# EAGLE design Power Board (EAGLE 9.6.2)
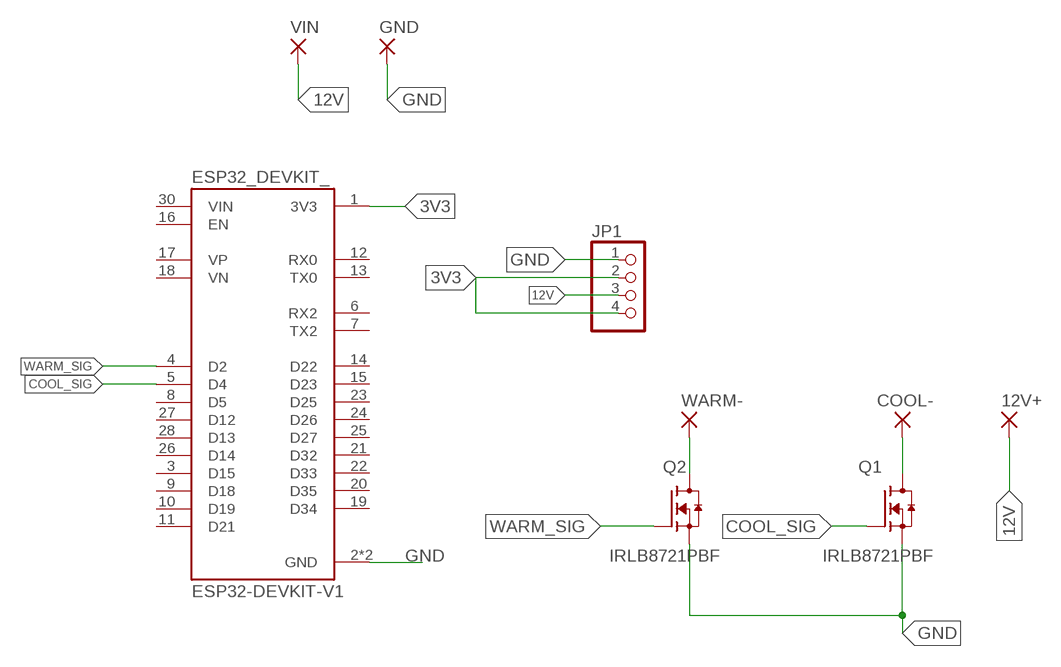
[diagram p0: schematic, sheet 1]

## Parts
12V+  WIREPADSMD5-2,5  [5-2,5]
COOL-  WIREPADSMD5-2,5  [5-2,5]
ESP32_DEVKIT_  ESP32-DEVKIT-V1  [MODULE_ESP32_DEVKIT_V1]
GND  WIREPADSMD5-2,5  [5-2,5]
JP1  PINHD-1X4  [1X04]
Q1  IRLB8721PBF  [TO254P1067X483X2057-3]
Q2  IRLB8721PBF  [TO254P1067X483X2057-3]
VIN  WIREPADSMD5-2,5  [5-2,5]
WARM-  WIREPADSMD5-2,5  [5-2,5]

## Nets
3V3 [POWER]: ESP32_DEVKIT_.1(3V3) JP1.2 JP1.4
12V [POWER]: 12V+.1(P) JP1.3 VIN.1(P)
COOL- [POWER]: COOL-.1(P) Q1.2(D)
COOL_SIG [SIGNAL]: ESP32_DEVKIT_.5(D4) Q1.1(G)
GND [POWER]: ESP32_DEVKIT_.2(GND) ESP32_DEVKIT_.29(GND) GND.1(P) JP1.1 Q1.3(S) Q2.3(S)
WARM- [POWER]: Q2.2(D) WARM-.1(P)
WARM_SIG [SIGNAL]: ESP32_DEVKIT_.4(D2) Q2.1(G)
Unconnected: ESP32_DEVKIT_.3(D15) ESP32_DEVKIT_.6(RX2) ESP32_DEVKIT_.7(TX2) ESP32_DEVKIT_.8(D5) ESP32_DEVKIT_.9(D18) ESP32_DEVKIT_.10(D19) ESP32_DEVKIT_.11(D21) ESP32_DEVKIT_.12(RX0) ESP32_DEVKIT_.13(TX0) ESP32_DEVKIT_.14(D22) ESP32_DEVKIT_.15(D23) ESP32_DEVKIT_.16(EN) ESP32_DEVKIT_.17(VP) ESP32_DEVKIT_.18(VN) ESP32_DEVKIT_.19(D34) ESP32_DEVKIT_.20(D35) ESP32_DEVKIT_.21(D32) ESP32_DEVKIT_.22(D33) ESP32_DEVKIT_.23(D25) ESP32_DEVKIT_.24(D26) ESP32_DEVKIT_.25(D27) ESP32_DEVKIT_.26(D14) ESP32_DEVKIT_.27(D12) ESP32_DEVKIT_.28(D13) ESP32_DEVKIT_.30(VIN)

## Library data of the parts
12V+ COOL- GND VIN WARM- = wirepad:WIREPAD: Wire PAD connect wire on PCB
ESP32_DEVKIT_ = ESP32-DEVKIT-V1:ESP32-DEVKIT-V1: Dual core, Wi-Fi: 2.4 GHz up to 150 Mbits/s,BLE (Bluetooth Low Energy) and legacy Bluetooth, 32 bits, Up to 240 MHz Check availability <https://pricing.snapeda.com/parts/ESP32-DEVKIT-V1/Do%20it/view-part?ref=eda>; AVAILABILITY: Not in stock; DESCRIPTION: Dual core, Wi-Fi: 2.4 GHz up to 150 Mbits/s,BLE (Bluetooth Low Energy) and legacy Bluetooth, 32 bits, Up to 240 MHz; MF: Do it; MP: ESP32-DEVKIT-V1; PACKAGE: None; PRICE: None
JP1 = pinhead:PINHD-1X4: PIN HEADER
Q1 Q2 = IRLB8721PBF:IRLB8721PBF: Single N-Channel 30 V 8.7 mOhm 13 nC HEXFET® Power Mosfet - TO-220-3 Check availability <https://pricing.snapeda.com/parts/IRLB8721PBF/Infineon%20Technologies/view-part?ref=eda>; AVAILABILITY: In Stock; DESCRIPTION: Very Low RDS(on) at 4.5V VGS | Ultra-Low Gate Impedance | Fully Characterized Avalanche Voltage and Current | Lead-Free; MF: Infineon Technologies; MP: IRLB8721PBF; PACKAGE: TO-220 Infineon; PRICE: None; PURCHASE-URL: https://pricing.snapeda.com/search/part/IRLB8721PBF/?ref=eda

## Net classes
1 POWER: width 0.305 mm

## Board
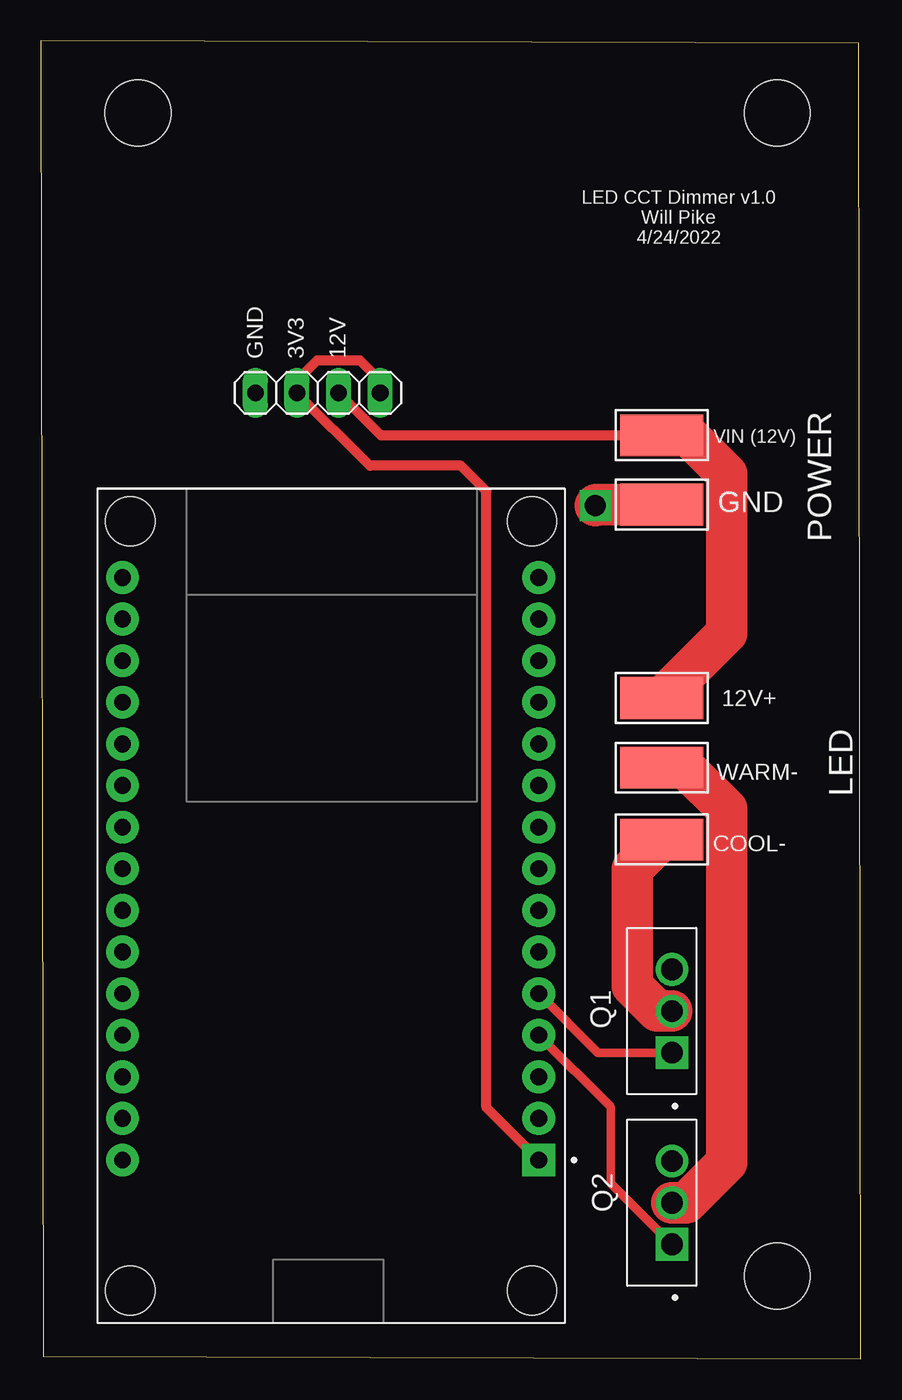
[diagram p1: board, top side]
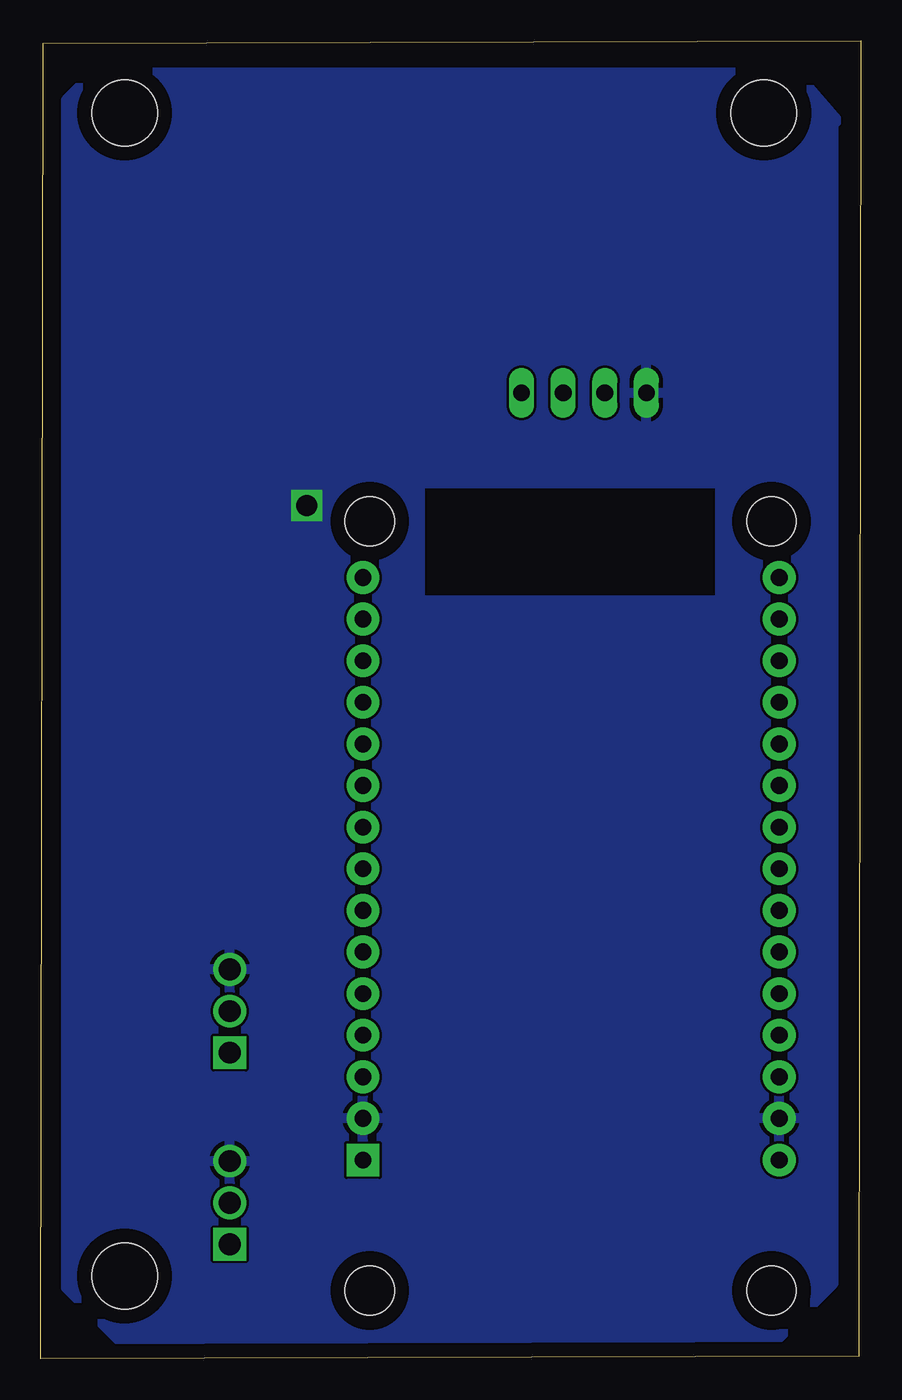
[diagram p2: board, bottom side, seen from below]

Size 50.03 x 80.43 mm. Coordinates in mm from the lower left corner, seen from the top.
Outline: 0.13,0.13 50.03,0 49.9,80.3 0,80.43 0.13,0.13
Copper layers (1*16): Top 0.035mm / dielectric 1.5mm / Bottom 0.035mm
Design rules "default *": minimum track width 6mil, minimum drill 0.3mm, track to track 6mil, track to pad 6mil, pad to pad 6mil, via to via 6mil, smd to smd 6mil, copper to edge 35mil, drill to drill 6mil, minimum pad ring 10mil, minimum via ring 8mil, stop-mask expansion 4mil, vias tented up to drill 0mil, thermal gap 10mil
Holes 4 mm at 5.92,76.03 44.92,76.03 44.92,5.03

### Footprints (pad centres in the part's own frame; a part is rotated, then mirrored left to right if it is on the bottom)
5-2,5 = smd 2.54 x 5.08: 1 0,0
MODULE_ESP32_DEVKIT_V1 = drill 1.02 pad 2 square: 1 -12.7,15.515 | drill 1.02 pad 2: 2 -12.7,12.975; 3 -12.7,10.435; 4 -12.7,7.895; 5 -12.7,5.355; 6 -12.7,2.815; 7 -12.7,0.275; 8 -12.7,-2.265; 9 -12.7,-4.805; 10 -12.7,-7.345; 11 -12.7,-9.885; 12 -12.7,-12.425; 13 -12.7,-14.965; 14 -12.7,-17.505; 15 -12.7,-20.045; 16 12.7,-20.045; 17 12.7,-17.505; 18 12.7,-14.965; 19 12.7,-12.425; 20 12.7,-9.885; 21 12.7,-7.345; 22 12.7,-4.805; 23 12.7,-2.265; 24 12.7,0.275; 25 12.7,2.815; 26 12.7,5.355; 27 12.7,7.895; 28 12.7,10.435; 29 12.7,12.975; 30 12.7,15.515 | hole 3: -12.28,-23.475; 12.23,-23.475; 12.23,23.475; -12.28,23.475
1X04 = drill 1.016 long: 1 -3.81,0; 2 -1.27,0; 3 1.27,0; 4 3.81,0
TO254P1067X483X2057-3 = drill 1.33 pad 2 square: 1 -2.54,0 | drill 1.33 pad 2: 2 0,0; 3 2.54,0

### Placement (x,y rotation side)
12V+  37.88,40.32 90 top
COOL-  37.88,31.68 90 top
ESP32_DEVKIT_  17.68,27.63 180 top
GND  37.88,52.13 270 top
JP1  16.89,58.94 0 top
Q1  38.5,21.21 90 top
Q2  38.5,9.51 90 top
VIN  37.88,56.36 90 top
WARM-  37.88,36.06 90 top

### Tracks (layer width: path | path; a pad name or v marks a point on that pad's centre or on a via)
3V3
  Top 0.61: ESP32_DEVKIT_.1 27.18,15.32 27.18,52.95 25.63,54.5 20.07,54.5 JP1.2 15.62,59.71 16.84,60.92 19.48,60.92 20.7,59.71 JP1.4
12V
  Top 0.61: JP1.3 20.74,56.36 VIN.1
  Top 2.54: VIN.1 39.46,56.36 41.84,53.99 41.84,44.28 12V+.1
COOL-
  Top 2.54: COOL-.1 36.08,29.88 36.08,22.75 37.62,21.21 Q1.2
COOL_SIG
  Top 0.508: Q1.1 33.99,18.67 ESP32_DEVKIT_.5
GND  (via drill 1.27)
  Top 2.54: GND.1 33.87,52.13 v33.81,52.07
  pour Bottom: 3.94,78.49 46.86,78.49 48.51,76.83 48.51,4.32 45.34,1.14 5.08,1.14 1.65,4.57 1.65,75.31 1.4,75.56
WARM-
  Top 2.54: WARM-.1 39.32,36.06 41.84,33.54 41.84,11.97 39.39,9.51 Q2.2
WARM_SIG
  Top 0.508: ESP32_DEVKIT_.4 34.77,15.35 34.77,10.71 Q2.1

### Text on the board
tNames: LED CCT Dimmer v1.0 / Will Pike / 4/24/2022 | GND | 3V3 | 12V | POWER | VIN (12V) | LED